# EAGLE design Own_USB-C_Breakout.pro_v4.0_Final_AR (EAGLE 9.6.2)
COMPANY: ADAFRUIT INDUSTRIES; DRAWN: KTOWN; REV: A; YEAR: 2019
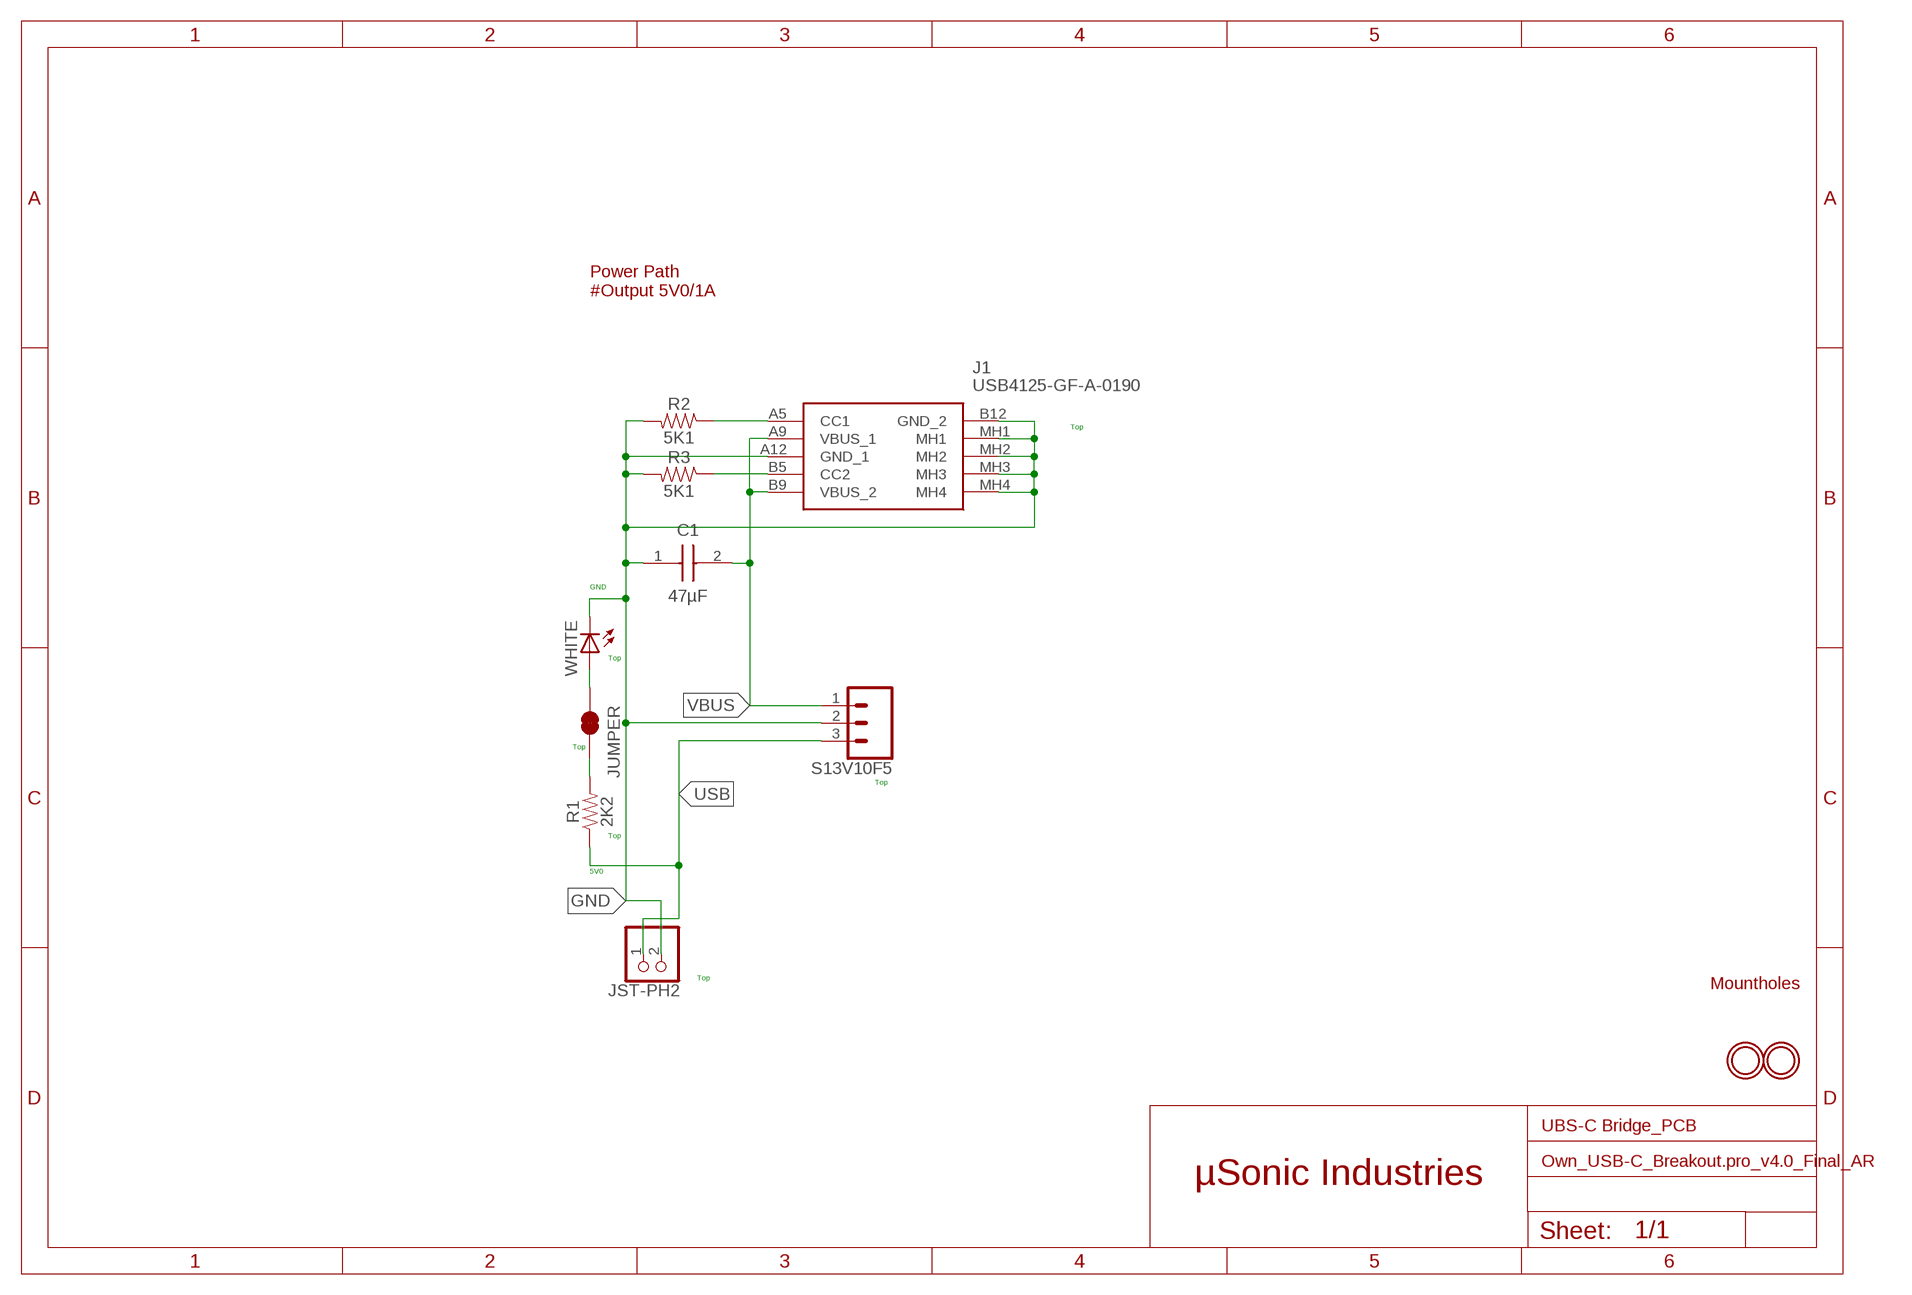
[diagram p0: schematic, sheet 1]

## Parts
C1  47µF  C5750X7R1V476M230KC  [CAPC5750X310N]
J1  USB4125-GF-A-0190  [USB4125GFA0190]
JST-PH2  JST_2PINOWN  [JST-PH-2-THMOWN]
JUMPER  JUMPER-SMT_2_NC_TRACE_SILK  [SMT-JUMPER_2_NC_TRACE_SILK]
R1  2K2  RESISTOR0805  [0805]
R2  5K1  RESISTOR0805  [0805]
R3  5K1  RESISTOR0805  [0805]
S13V10F5  CONN_031X03_NO_SILK  [1X03_NO_SILK]
U$1  MOUNTINGHOLE2.5  [MOUNTINGHOLE_2.5_PLATED]
U$2  MOUNTINGHOLE2.5  [MOUNTINGHOLE_2.5_PLATED]
WHITE  LEDCHIPLED_0805  [CHIPLED_0805]

## Nets
GND: C1.1 J1.A12(GND_1) J1.B12(GND_2) J1.MH1 J1.MH2 J1.MH3 J1.MH4 JST-PH2.2 R2.2 R3.2 S13V10F5.2 WHITE.C
JUMPER1: JUMPER.1 WHITE.A
JUMPER2: JUMPER.2 R1.2
N$3: J1.B5(CC2) R3.1
N$4: J1.A5(CC1) R2.1
USB: JST-PH2.1 R1.1 S13V10F5.3
VBUS: C1.2 J1.A9(VBUS_1) J1.B9(VBUS_2) S13V10F5.1

## Notes on the sheet
- Power Path
  #Output 5V0/1A
- Top
- GND
- Top
- Top
- Top
- Top
- 5V0
- Top
- Mountholes
- UBS-C Bridge_PCB
- µSonic Industries

## Library data of the parts
C1 = C5750X7R1V476M230KC:C5750X7R1V476M230KC: Multilayer Ceramic Chip Capacitors, Capacitance=47?F, LxWxT:5.7x5x2.3mm Source: Datasheet <https://product.tdk.com/system/files/dam/doc/product/capacitor/ceramic/mlcc/catalog/mlcc_commercial_general_en.pdf>; DESCRIPTION: Multilayer Ceramic Chip Capacitors, Capacitance=47?F, LxWxT:5.7x5x2.3mm; HEIGHT: 3.1mm; MANUFACTURER_NAME: TDK; MANUFACTURER_PART_NUMBER: C5750X7R1V476M230KC; MOUSER_PART_NUMBER: 810-C5750X7R1V476M23; MOUSER_PRICE-STOCK: https://www.mouser.co.uk/ProductDetail/TDK/C5750X7R1V476M230KC?qs=rSMjJ%252B1ewcSIfs95ZgB3Sw%3D%3D
J1 = USB4125-GF-A-0190:USB4125-GF-A-0190: USB Connectors USB C Rec GF RA 6P SMT TH Stakes 1.9mm Source: Datasheet <https://eu.mouser.com/datasheet/2/837/usb4125-2448699.pdf>; DESCRIPTION: USB Connectors USB C Rec GF RA 6P SMT TH Stakes 1.9mm; HEIGHT: 3.41mm; MANUFACTURER_NAME: GCT (GLOBAL CONNECTOR TECHNOLOGY); MANUFACTURER_PART_NUMBER: USB4125-GF-A-0190; MOUSER_PART_NUMBER: 640-USB4125-GF-A-190; MOUSER_PRICE-STOCK: https://www.mouser.co.uk/ProductDetail/GCT/USB4125-GF-A-0190?qs=QNEnbhJQKvbCz4hEJBS24w%3D%3D
JST-PH2 = adafruit2:JST_2PIN: JST 2-Pin Connectors of various flavors SMT-RA (S2B-PH-SM4) 4UConnector #17311 SMT (B2B-PH-SM4) THM-RA (S2B-PH) THM (B2B-PH)
JUMPER = SparkFun-Jumpers:JUMPER-SMT_2_NC_TRACE: Normally closed trace jumper This jumper has a trace between two pads so it's normally closed (NC). Use a razor knife to open the connection. For best results follow the IPC guidelines for cutting traces: Cutout at least 0.063 mm (0.005 in). Remove all loose material to clean up the cut area. Seal the cut with an approved epoxy. Reapply solder to reclose the connection.
R1-R3 = SparkFun-Resistors:RESISTOR: Generic Resistor Package
S13V10F5 = SparkFun-Connectors2:CONN_03: Multi connection point. Often used as Generic Header-pin footprint for 0.1 inch spaced/style header connections On any of the 0.1 inch spaced packages, you can populate with these: Break Away Headers - Straight <https://www.sparkfun.com/products/116> (PRT-00116) Break Away Male Headers - Right Angle <https://www.sparkfun.com/products/553> (PRT-00553) Female Headers <https://www.sparkfun.com/products/115> (PRT-00115) Break Away Headers - Machine Pin <https://www.sparkfun.com/products/117> (PRT-00117) Break Away Female Headers - Swiss Machine Pin <https://www.sparkfun.com/products/743> (PRT-00743) Stackable Header - 3 Pin (Female, 0.1") <https://www.sparkfun.com/products/13875> (PRT-13875) For SCREWTERMINALS and SPRING TERMINALS visit here: Screw Terimnals on SparkFun.com <https://www.sparkfun.com/search/results?term=Screw+Terminals> (5mm/3.5mm/2.54mm spacing) This device is also useful as a general connection point to wire up your design to another part of your project. Our various solder wires solder well into these plated through hole pads. Hook-Up Wire - Assortment (Stranded, 22 AWG) <https://www.sparkfun.com/products/11375> (PRT-11375) Hook-Up Wire - Assortment (Solid Core, 22 AWG) <https://www.sparkfun.com/products/11367> (PRT-11367) View the entire wire category on our website here <https://www.sparkfun.com/categories/141> Special notes: Molex polarized connector foot print use with SKU : PRT-08232 with associated crimp pins and housings.
U$1 U$2 = microbuilder:MOUNTINGHOLE: Mounting Hole For #2 screws (0.086"/2.18mm width, 0.094"/2.4mm hole) use 2.5mm; BOM: EXCLUDE
WHITE = adafruit:LED: LED OSRAM: - CHIPLED LG R971, LG N971, LY N971, LG Q971, LY Q971, LO R971, LY R971 LH N974, LH R974 LS Q976, LO Q976, LY Q976 LO Q996 - Hyper CHIPLED LW Q18S LB Q993, LB Q99A, LB R99A - SideLED LS A670, LO A670, LY A670, LG A670, LP A670 LB A673, LV A673, LT A673, LW A673 LH A674 LY A675 LS A676, LA A676, LO A676, LY A676, LW A676 LS A679, LY A679, LG A679 - Hyper Micro SIDELED® LS Y876, LA Y876, LO Y876, LY Y876 LT Y87S - SmartLED LW L88C, LW L88S LB L89C, LB L89S, LG L890 LS L89K, LO L89K, LY L89K LS L896, LA L896, LO L896, LY L896 - TOPLED LS T670, LO T670, LY T670, LG T670, LP T670 LSG T670, LSP T670, LSY T670, LOP T670, LYG T670 LG T671, LOG T671, LSG T671 LB T673, LV T673, LT T673, LW T673 LH T674 LS T676, LA T676, LO T676, LY T676, LB T676, LH T676, LSB T676, LW T676 LB T67C, LV T67C, LT T67C, LS T67K, LO T67K, LY T67K, LW E67C LS E67B, LA E67B, LO E67B, LY E67B, LB E67C, LV E67C, LT E67C LW T67C LS T679, LY T679, LG T679 LS T770, LO T770, LY T770, LG T770, LP T770 LB T773, LV T773, LT T773, LW T773 LH T774 LS E675, LA E675, LY E675, LS T675 LS T776, LA T776, LO T776, LY T776, LB T776 LHGB T686 LT T68C, LB T68C - Hyper Mini TOPLED® LB M676 - Mini TOPLED Santana® LG M470 LS M47K, LO M47K, LY M47K Source: http://www.osram.convergy.de/

## Net classes
0 default: width 0.25 mm

## Board
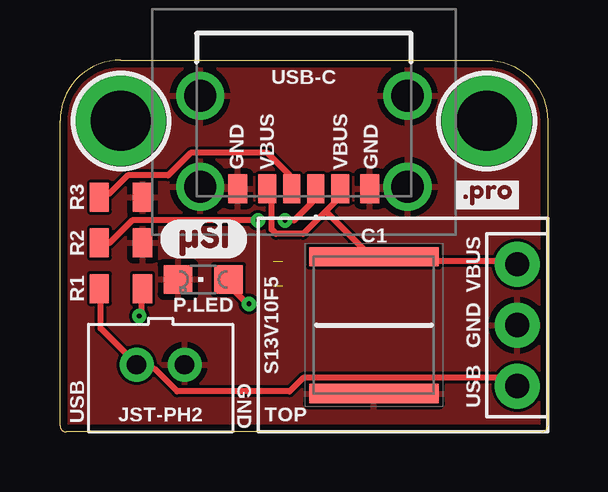
[diagram p1: board, top side]
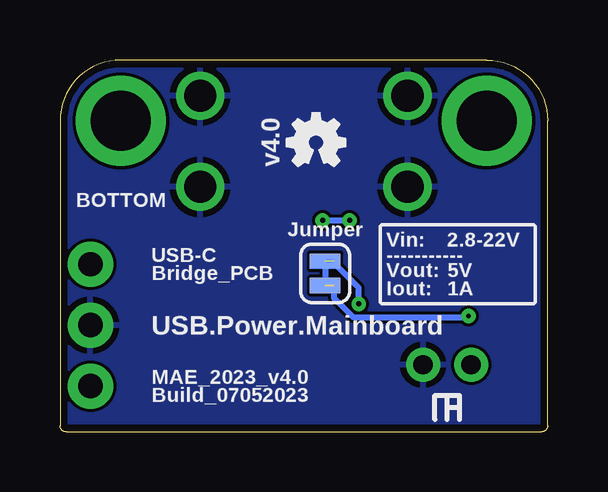
[diagram p2: board, bottom side, seen from below]

Size 20.32 x 15.49 mm. Coordinates in mm from the lower left corner, seen from the top.
Outline: 2.54,15.49 17.78,15.49 arc-90 20.32,12.95 20.32,0.25 arc-90 20.07,0 0.25,0 arc-90 0,0.25 0,12.95 arc-90 2.54,15.49
Copper layers (1*16): Top 0.035mm / dielectric 1.5mm / Bottom 0.035mm
Design rules "aisler_2_layer_complex": minimum track width 0.125mm, minimum drill 0.2mm, track to track 0.125mm, track to pad 0.125mm, pad to pad 0.125mm, via to via 0.125mm, smd to smd 0.125mm, copper to edge 0.3mm, drill to drill 0.25mm, minimum pad ring 0.2mm, minimum via ring 0.2mm, stop-mask expansion 0mil, vias tented up to drill 0mil, thermal gap 10mil

### Footprints (pad centres in the part's own frame; a part is rotated, then mirrored left to right if it is on the bottom)
CAPC5750X310N = smd 0.81 x 5.41: 1 -2.85,0; 2 2.85,0
USB4125GFA0190 = smd 0.7 x 1.2: A5 -0.5,3.08; B5 0.5,3.08 | smd 0.76 x 1.2: A9 1.52,3.08; B9 -1.52,3.08 | smd 0.8 x 1.2: A12 2.75,3.08; B12 -2.75,3.08 | drill 1.34 pad 2.01: MH1 -4.32,3; MH2 -4.32,-0.8; MH3 4.32,-0.8; MH4 4.32,3
JST-PH-2-THMOWN = drill 0.8 pad 1.422: 1 1,0; 2 -1,0
SMT-JUMPER_2_NC_TRACE_SILK = smd 0.635 x 1.27: 1 -0.508,0; 2 0.508,0
0805 = smd 0.8 x 1.2: 1 -0.9,0; 2 0.9,0
1X03_NO_SILK = drill 1.016 pad 1.88: 1 0,0; 2 2.54,0; 3 5.08,0
MOUNTINGHOLE_2.5_PLATED = drill 2.5 pad 3.2: P$1 0,0
CHIPLED_0805 = smd 1.2 x 1.2: A 0,-1.05; C 0,1.05

### Placement (x,y rotation side)
C1  13.08,4.45 90 top
J1  10.16,13.21 180 top
JST-PH2  4.19,2.79 180 top
JUMPER  9.27,6.6 270 bottom
R1  2.54,5.97 0 top
R2  2.54,7.87 0 top
R3  2.54,9.78 0 top
S13V10F5  19.05,6.99 270 top
U$1  17.78,12.95 180 top
U$2  2.54,12.95 180 top
U$4  [PRO2]  16.51,9.27 0 top
U$6  [OSHW-LOGO-MINI]  9.65,12.06 0 bottom
U$7  [µSI2]  4.19,7.24 0 top
WHITE  5.97,6.35 90 top

### Tracks (layer width: path | path; a pad name or v marks a point on that pad's centre or on a via)
GND
  pour Top: 0,0 20.32,0 20.32,15.49 0,15.49
  pour Bottom: 0,0 20.32,0 20.32,15.49 0,15.49
JUMPER1  (via drill 0.2)  (1 unrouted)
  Top 0.25: v7.87,5.33 7.69,5.44 6.94,6.19 WHITE.A
  Bottom 0.25: 8.89,7.11 8.89,7.03 7.87,6 v7.87,5.33
JUMPER2  (via drill 0.2)  (1 unrouted)
  Top 0.25: v3.3,4.83 3.38,4.88 3.38,5.81 R1.2
  Bottom 0.25: v3.3,4.83 3.34,4.78 8.1,4.78 8.89,5.58 8.89,6.1
N$3
  Top 0.25: R3.1 1.69,9.94 2.06,9.94 2.81,10.69 4.5,10.69 5.44,11.62 8.62,11.62 9.56,10.69 9.56,10.31 J1.B5
N$4  (via drill 0.2)
  Top 0.25: v8.25,8.81 3,8.81 2.06,7.88 1.69,7.88 R2.1 | v9.38,8.81 9.75,8.81 10.5,9.56 10.5,10.12 J1.A5
  Bottom 0.25: v9.38,8.81 v8.25,8.81
USB
  Top 0.25: R1.1 1.69,5.81 1.69,4.31 3.19,2.81 JST-PH2.1 3.38,2.62 3.94,2.62 4.88,1.69 9.56,1.69 10.12,2.25 18.75,2.25 18.94,2.06 S13V10F5.3
VBUS
  Top 0.25: 11.06,9.19 11.62,9.75 11.62,10.12 J1.B9 | 11.06,9.19 10.12,8.25 9,8.25 8.81,8.44 8.81,10.12 J1.A9 | 11.06,9.19 12.94,7.31 C1.2 13.12,7.12 18.94,7.12 S13V10F5.1

### Text on the board
tPlace: USB-C | GND | VBUS | VBUS | GND | R3 | R2 | C1 | VBUS | R1 | P.LED | S13V10F5 | GND | USB | GND | USB | JST-PH2 | TOP
bPlace: v4.0 | BOTTOM | 2.8-22V | Vin: | Jumper | 5V | ----------- | Vout: | USB-C / Bridge_PCB | 1A | Iout: | USB.Power.Mainboard | MAE_2023_v4.0 / Build_07052023